# EAGLE design Seven Seg Control - Schematic (EAGLE 6.5.0)
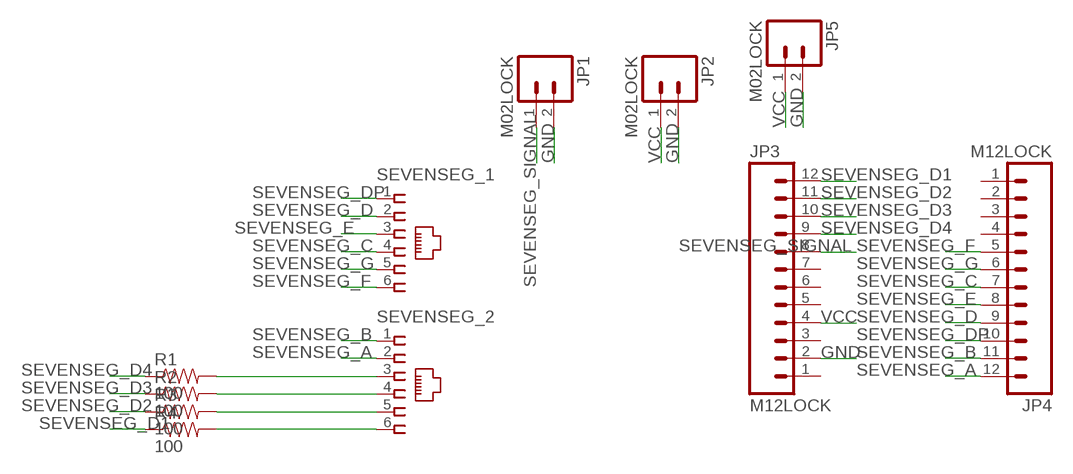
[diagram p0: schematic, sheet 1]

## Parts
JP1  M02LOCK  [1X02_LOCK]
JP2  M02LOCK  [1X02_LOCK]
JP3  M12LOCK  [1X12_LOCK]
JP4  M12LOCK  [1X12_LOCK]
JP5  M02LOCK  [1X02_LOCK]
R1  100  RESISTOR0603  [0603-RES]
R2  100  RESISTOR0603  [0603-RES]
R3  100  RESISTOR0603  [0603-RES]
R4  100  RESISTOR0603  [0603-RES]
SEVENSEG_1  555165-1  [555165-1]
SEVENSEG_2  555165-1  [555165-1]

## Nets
GND: JP1.2 JP2.2 JP3.2 JP5.2
N$1: R4.2 SEVENSEG_2.6
N$2: R2.2 SEVENSEG_2.4
N$3: R3.2 SEVENSEG_2.5
N$4: R1.2 SEVENSEG_2.3
SEVENSEG_A: JP4.12 SEVENSEG_2.2
SEVENSEG_B: JP4.11 SEVENSEG_2.1
SEVENSEG_C: JP4.7 SEVENSEG_1.4
SEVENSEG_D: JP4.9 SEVENSEG_1.2
SEVENSEG_D1: JP3.12 R4.1
SEVENSEG_D2: JP3.11 R3.1
SEVENSEG_D3: JP3.10 R2.1
SEVENSEG_D4: JP3.9 R1.1
SEVENSEG_DP: JP4.10 SEVENSEG_1.1
SEVENSEG_E: JP4.8 SEVENSEG_1.3
SEVENSEG_F: JP4.5 SEVENSEG_1.6
SEVENSEG_G: JP4.6 SEVENSEG_1.5
SEVENSEG_SIGNAL: JP1.1 JP3.8
VCC: JP2.1 JP3.4 JP5.1
Unconnected: JP3.1 JP3.3 JP3.5 JP3.6 JP3.7 JP4.1 JP4.2 JP4.3 JP4.4

## Library data of the parts
JP1 JP2 JP5 = SparkFun-Connectors:M02: Standard 2-pin 0.1" header. Use with - straight break away headers ( PRT-00116) - right angle break away headers (PRT-00553) - swiss pins (PRT-00743) - machine pins (PRT-00117) - female headers (PRT-00115) Molex polarized connector foot print use with: PRT-08233 with associated crimp pins and housings. 2.54_SCREWTERM for use with PRT-10571. 3.5mm Screw Terminal footprints for PRT-08084 5mm Screw Terminal footprints for use with PRT-08433
JP3 JP4 = SparkFun-Connectors:M12: Header 12 Standard 12-pin 0.1" header. Use with straight break away headers (SKU : PRT-00116), right angle break away headers (PRT-00553), swiss pins (PRT-00743), machine pins (PRT-00117), and female headers (PRT-00115).
R1-R4 = SparkFun-Resistors:RESISTOR: Resistor Basic schematic elements and footprints for 0603, 1206, and PTH resistors.
SEVENSEG_1 SEVENSEG_2 = con-amp:555165-1: AMP connector

## Board
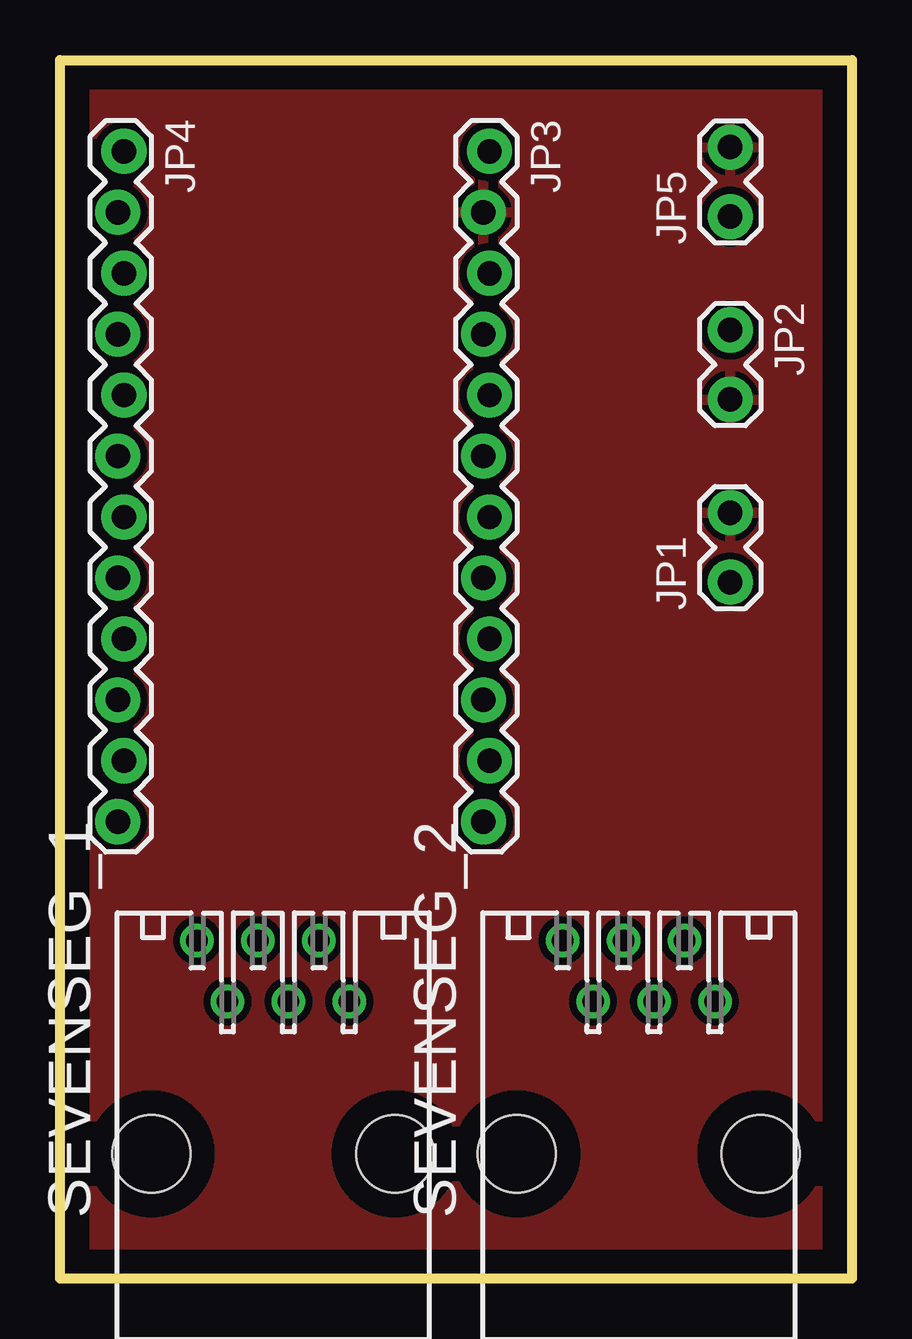
[diagram p1: board, top side]
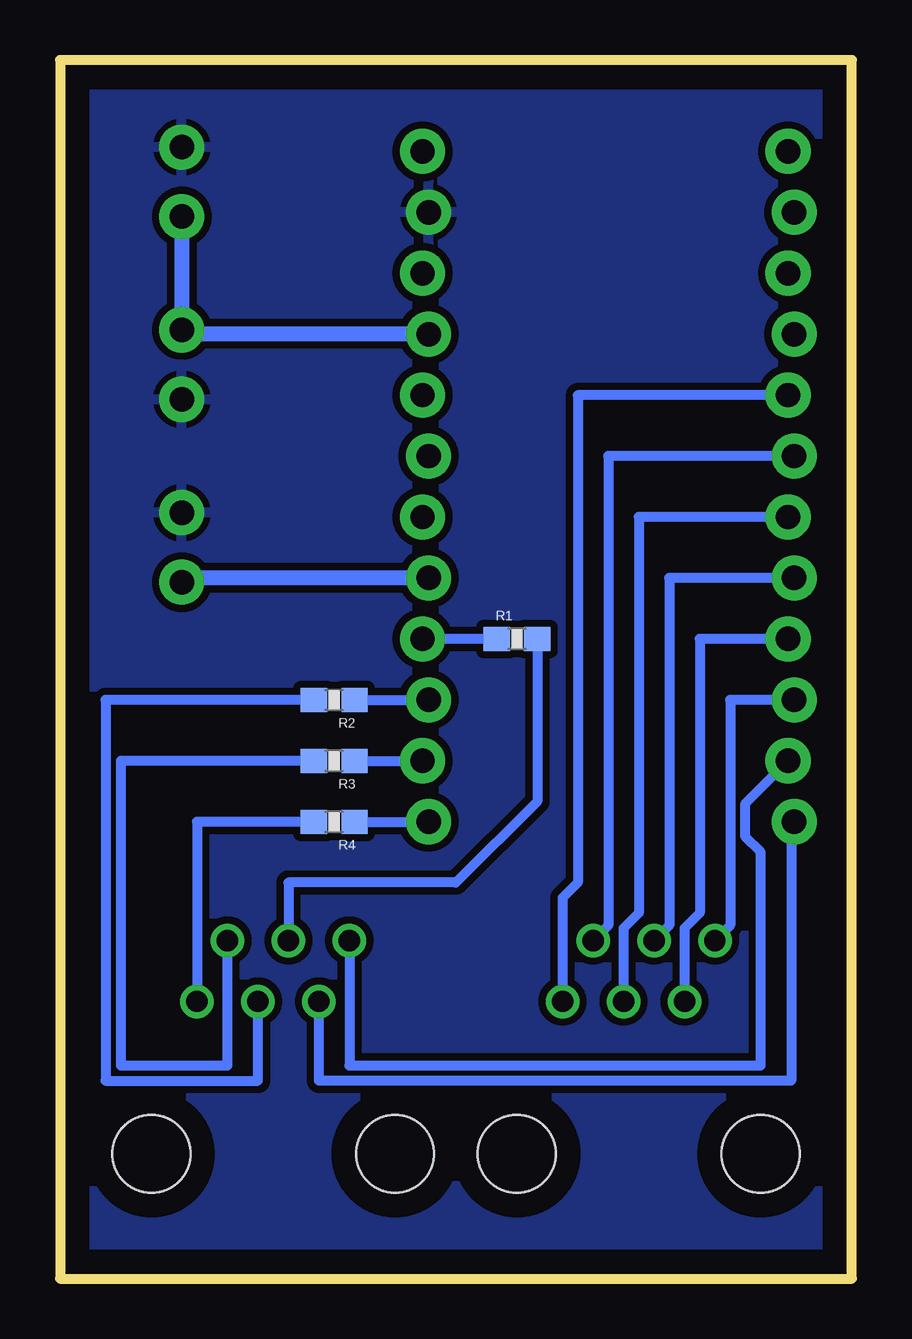
[diagram p2: board, bottom side, seen from below]

Size 33.02 x 50.8 mm. Coordinates in mm from the lower left corner, seen from the top.
Outline: 0,0 0,50.8 33.02,50.8 33.02,0 0,0
Copper layers (1*16): Top 0.035mm / dielectric 1.5mm / Bottom 0.035mm
Design rules "default": minimum track width 10mil, minimum drill 24mil, track to track 8mil, track to pad 8mil, pad to pad 8mil, via to via 8mil, smd to smd 8mil, copper to edge 40mil, drill to drill 8mil, minimum pad ring 10mil, minimum via ring 8mil, stop-mask expansion 4mil, vias tented up to drill 0mil, thermal gap 10mil

### Footprints (pad centres in the part's own frame; a part is rotated, then mirrored left to right if it is on the bottom)
1X02_LOCK = drill 1.016 pad 1.88: 1 -0.178,0; 2 2.718,0
1X12_LOCK = drill 1.016 pad 1.88: 1 0,0.127; 2 2.54,-0.127; 3 5.08,0.127; 4 7.62,-0.127; 5 10.16,0.127; 6 12.7,-0.127; 7 15.24,0.127; 8 17.78,-0.127; 9 20.32,0.127; 10 22.86,-0.127; 11 25.4,0.127; 12 27.94,-0.127
0603-RES = smd 1.1 x 1: 1 -0.85,0; 2 0.85,0
555165-1 = drill 0.889: 1 -3.175,7.747; 2 -1.905,5.207; 3 -0.635,7.747; 4 0.635,5.207; 5 1.905,7.747; 6 3.175,5.207 | hole 3.251: -5.08,-1.143; 5.08,-1.143

### Placement (x,y rotation side)
JP1  27.94,29.21 90 top
JP2  27.94,39.37 270 top
JP3  17.78,46.99 270 top
JP4  2.54,46.99 270 top
JP5  27.94,44.45 90 top
R1  13.97,26.67 0 bottom
R2  21.59,24.13 180 bottom
R3  21.59,21.59 180 bottom
R4  21.59,19.05 180 bottom
SEVENSEG_1  8.89,6.35 0 top
SEVENSEG_2  24.13,6.35 0 top

### Tracks (layer width: path | path; a pad name or v marks a point on that pad's centre or on a via)
GND
  pour Bottom (isolate 0.305): 0,0 0,50.8 33.02,50.8 33.02,0
  pour Top (isolate 0.305): 0,0 0,50.8 33.02,50.8 33.02,0
N$1
  Bottom 0.406: R4.2 27.3,19.05 SEVENSEG_2.6
N$2
  Bottom 0.406: SEVENSEG_2.4 24.77,8.26 31.11,8.26 31.11,24.13 R2.2
N$3
  Bottom 0.406: R3.2 30.48,21.59 30.48,8.89 26.04,8.89 SEVENSEG_2.5
N$4
  Bottom 0.406: R1.2 13.12,19.9 16.51,16.51 23.5,16.51 SEVENSEG_2.3
SEVENSEG_A
  Bottom 0.406: JP4.12 2.54,18.92 2.54,8.26 22.23,8.26 SEVENSEG_2.2
SEVENSEG_B
  Bottom 0.406: SEVENSEG_2.1 20.95,8.89 3.81,8.89 3.81,17.78 4.45,18.41 4.45,19.81 JP4.11
SEVENSEG_C
  Bottom 0.406: JP4.7 8.89,31.75 8.89,15.24 9.53,14.61 SEVENSEG_1.4
SEVENSEG_D
  Bottom 0.406: JP4.9 6.35,26.67 6.35,15.24 6.99,14.61 SEVENSEG_1.2
SEVENSEG_D1
  Bottom 0.406: R4.1 JP3.12
SEVENSEG_D2
  Bottom 0.406: R3.1 JP3.11
SEVENSEG_D3
  Bottom 0.406: R2.1 JP3.10
SEVENSEG_D4
  Bottom 0.406: R1.1 JP3.9
SEVENSEG_DP
  Bottom 0.406: JP4.10 5.08,24.13 5.08,14.73 SEVENSEG_1.1
SEVENSEG_E
  Bottom 0.406: JP4.8 7.62,29.21 7.62,14.73 SEVENSEG_1.3
SEVENSEG_F
  Bottom 0.406: JP4.5 11.43,36.83 11.43,16.51 12.06,15.88 SEVENSEG_1.6
SEVENSEG_G
  Bottom 0.406: JP4.6 10.16,34.29 10.16,14.73 SEVENSEG_1.5
SEVENSEG_SIGNAL
  Bottom 0.635: JP3.8 27.76,29.21 JP1.1
VCC
  Bottom 0.635: JP3.4 27.76,39.37 JP2.1 JP5.1